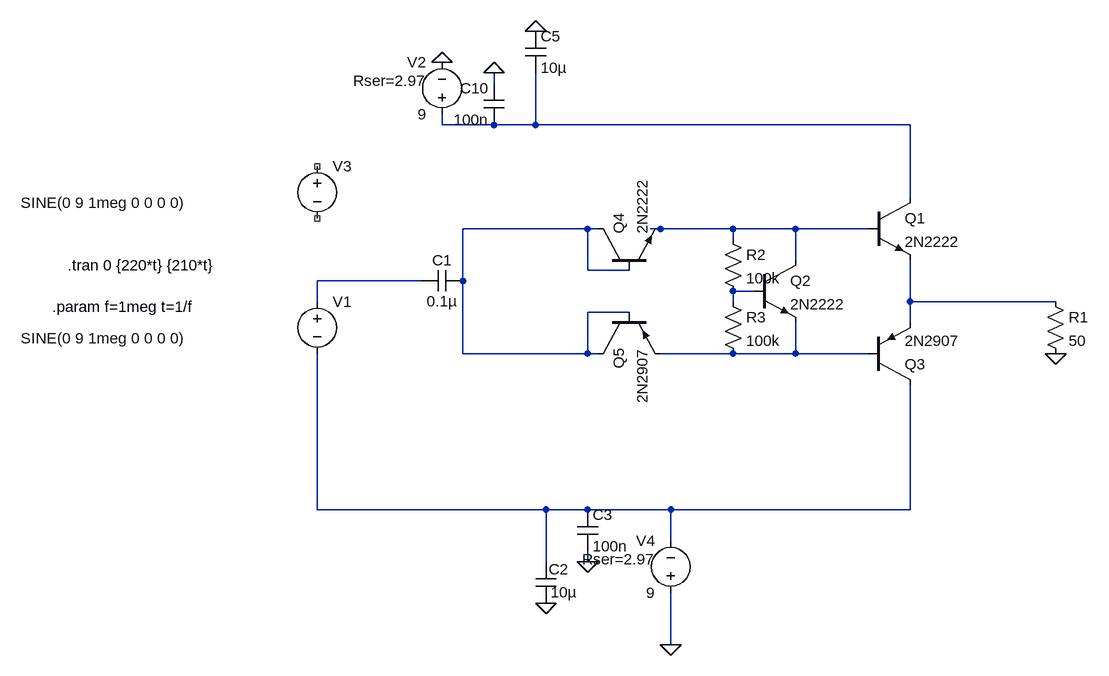
[diagram p0: schematic sinewave buffer draft.asc]
sinewave buffer draft.asc, the LTspice schematic file:
Version 4.1
SHEET 1 1256 724
WIRE 288 -160 288 -176
WIRE 208 -96 208 -112
WIRE 288 -96 208 -96
WIRE 352 -96 352 -176
WIRE 352 -96 288 -96
WIRE 928 -96 352 -96
WIRE 928 16 928 -96
WIRE 432 64 240 64
WIRE 448 64 432 64
WIRE 544 64 528 64
WIRE 656 64 544 64
WIRE 752 64 656 64
WIRE 864 64 752 64
WIRE 656 80 656 64
WIRE 752 112 752 64
WIRE 432 128 432 64
WIRE 496 128 432 128
WIRE 176 144 16 144
WIRE 240 144 240 64
WIRE 688 160 656 160
WIRE 16 176 16 144
WIRE 656 176 656 160
WIRE 928 176 928 112
WIRE 1152 176 928 176
WIRE 496 192 432 192
WIRE 928 208 928 176
WIRE 240 256 240 144
WIRE 432 256 432 192
WIRE 432 256 240 256
WIRE 448 256 432 256
WIRE 656 256 544 256
WIRE 752 256 752 208
WIRE 752 256 656 256
WIRE 864 256 752 256
WIRE 16 496 16 256
WIRE 368 496 16 496
WIRE 432 496 368 496
WIRE 560 496 432 496
WIRE 928 496 928 304
WIRE 928 496 560 496
WIRE 560 544 560 496
WIRE 368 576 368 496
WIRE 432 576 432 560
WIRE 560 704 560 624
FLAG 208 -192 0
FLAG 352 -240 0
FLAG 288 -176 0
FLAG 560 704 0
FLAG 1152 256 0
FLAG 368 640 0
FLAG 432 576 0
SYMBOL voltage 16 160 R0
WINDOW 123 0 0 Left 0
WINDOW 39 0 0 Left 0
WINDOW 3 -456 72 Left 2
SYMATTR Value SINE(0 9 1meg 0 0 0 0)
SYMATTR InstName V1
SYMBOL voltage 208 -96 R180
WINDOW 0 24 96 Left 2
WINDOW 3 24 16 Left 2
WINDOW 123 0 0 Left 0
WINDOW 39 24 68 Left 2
SYMATTR InstName V2
SYMATTR Value 9
SYMATTR SpiceLine Rser=2.97
SYMBOL cap 336 -240 R0
SYMATTR InstName C5
SYMATTR Value 10µ
SYMBOL cap 304 -96 R180
WINDOW 0 24 56 Left 2
WINDOW 3 24 8 Left 2
SYMATTR InstName C10
SYMATTR Value 100n
SYMBOL npn 864 16 R0
SYMATTR InstName Q1
SYMATTR Value 2N2222
SYMBOL pnp 864 304 M180
SYMATTR InstName Q3
SYMATTR Value 2N2907
SYMBOL voltage 560 640 R180
WINDOW 0 24 96 Left 2
WINDOW 3 24 16 Left 2
WINDOW 123 0 0 Left 0
WINDOW 39 24 68 Left 2
SYMATTR InstName V4
SYMATTR Value 9
SYMATTR SpiceLine Rser=2.97
SYMBOL cap 384 640 R180
WINDOW 0 -19 52 Left 2
WINDOW 3 -32 17 Left 2
SYMATTR InstName C2
SYMATTR Value 10µ
SYMBOL cap 416 496 R0
SYMATTR InstName C3
SYMATTR Value 100n
SYMBOL res 1136 160 R0
SYMATTR InstName R1
SYMATTR Value 50
SYMBOL cap 240 128 R90
WINDOW 0 0 32 VBottom 2
WINDOW 3 32 32 VTop 2
SYMATTR InstName C1
SYMATTR Value 0.1µ
SYMBOL res 640 160 R0
SYMATTR InstName R3
SYMATTR Value 100k
SYMBOL npn 688 112 R0
SYMATTR InstName Q2
SYMATTR Value 2N2222
SYMBOL npn 448 128 R270
SYMATTR InstName Q4
SYMATTR Value 2N2222
SYMBOL pnp 448 192 M90
SYMATTR InstName Q5
SYMATTR Value 2N2907
SYMBOL res 640 64 R0
SYMATTR InstName R2
SYMATTR Value 100k
SYMBOL voltage 16 -48 R0
WINDOW 123 0 0 Left 0
WINDOW 39 0 0 Left 0
WINDOW 3 -456 72 Left 2
SYMATTR Value SINE(0 9 1meg 0 0 0 0)
SYMATTR InstName V3
TEXT -368 120 Left 2 !.tran 0 {220*t} {210*t}
TEXT -392 184 Left 2 !.param f=1meg t=1/f

The netlist it stands for:
* sinewave buffer draft.asc
V1 N004 N008 SINE(0 9 1meg 0 0 0 0)
V2 N001 0 9 Rser=2.97
C5 0 N001 10µ
C10 N001 0 100n
Q1 N001 N003 N006 0 2N2222
Q3 N008 N007 N006 0 2N2907
V4 0 N008 9 Rser=2.97
C2 0 N008 10µ
C3 N008 0 100n
R1 N006 0 50
C1 N002 N004 0.1µ
R3 N005 N007 100k
Q2 N003 N005 N007 0 2N2222
Q4 N002 N002 N003 0 2N2222
Q5 N002 N002 N007 0 2N2907
R2 N003 N005 100k
V3 NC_01 NC_02 SINE(0 9 1meg 0 0 0 0)
.model NPN NPN
.model PNP PNP
.lib standard.bjt
.tran 0 {220*t} {210*t}
.param f=1meg t=1/f
.backanno
.end